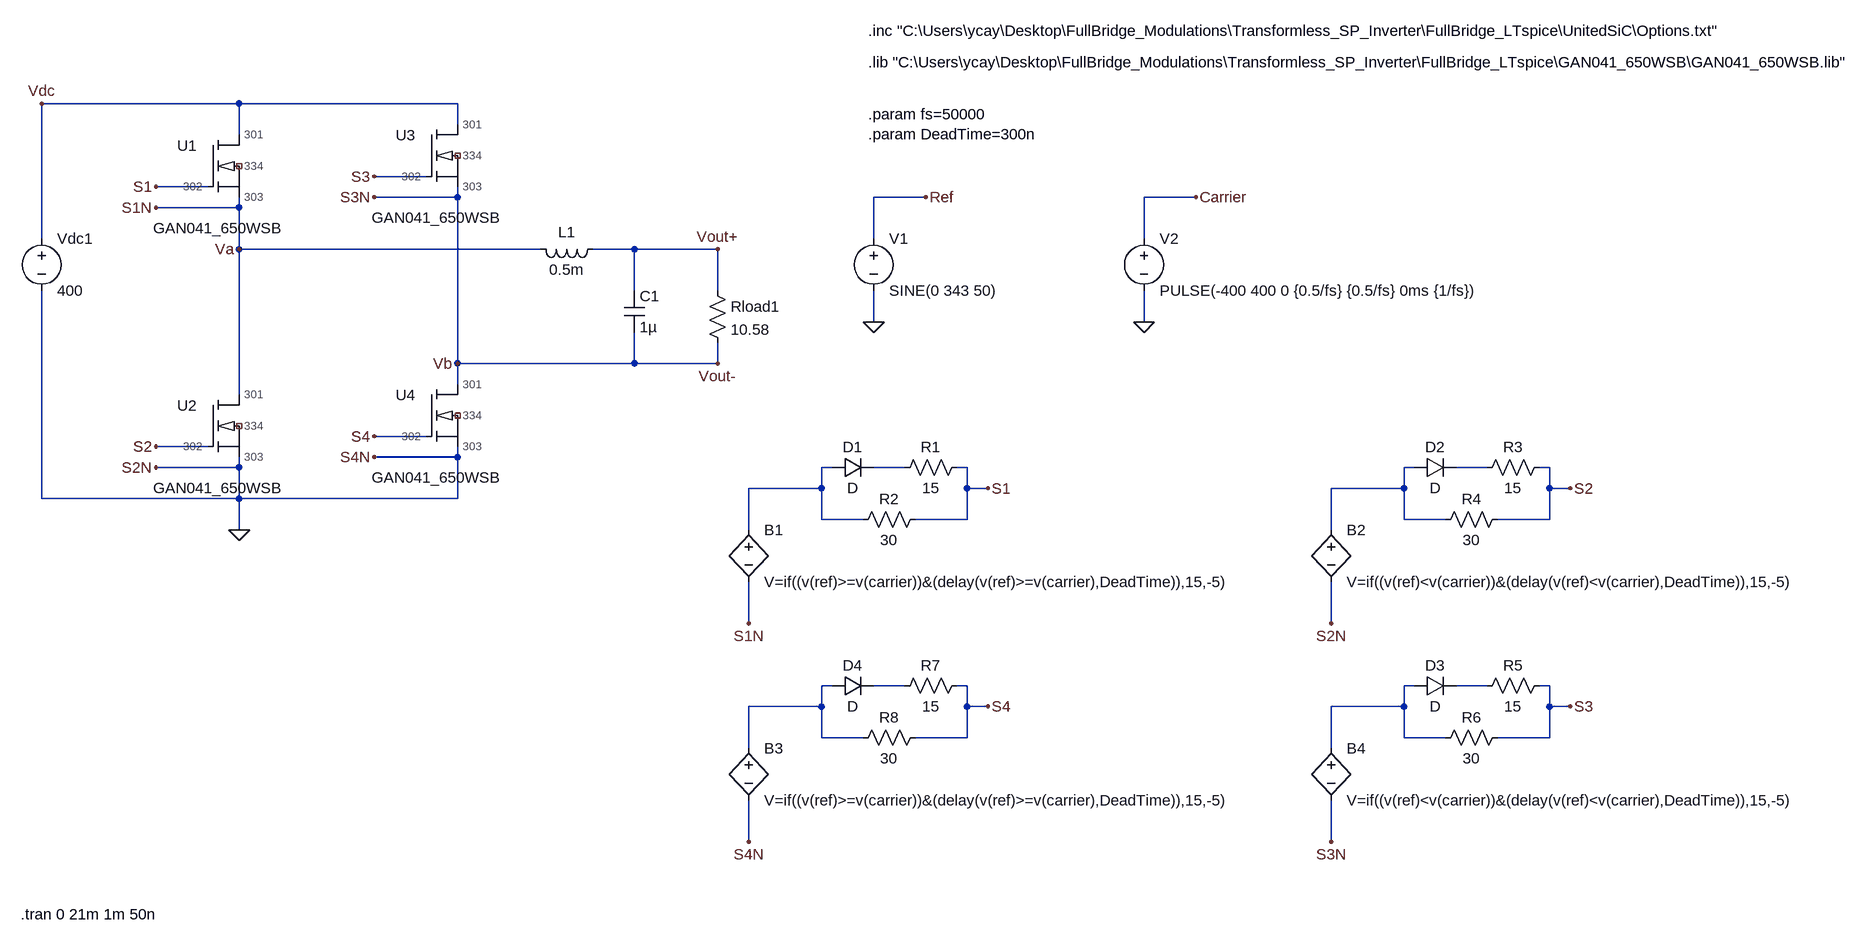
[diagram p0: schematic Bipolar_GAN041_650WSB.asc]
Bipolar_GAN041_650WSB.asc, the LTspice schematic file:
Version 4
SHEET 1 1652 768
WIRE -992 -496 -1296 -496
WIRE -656 -496 -992 -496
WIRE -656 -464 -656 -496
WIRE -992 -448 -992 -496
WIRE -704 -384 -784 -384
WIRE -1040 -368 -1120 -368
WIRE -656 -352 -656 -368
WIRE -656 -352 -784 -352
WIRE 64 -352 -16 -352
WIRE 480 -352 400 -352
WIRE -992 -336 -992 -352
WIRE -992 -336 -1120 -336
WIRE -1296 -288 -1296 -496
WIRE -16 -288 -16 -352
WIRE 400 -288 400 -352
WIRE -992 -272 -992 -336
WIRE -528 -272 -992 -272
WIRE -384 -272 -448 -272
WIRE -256 -272 -384 -272
WIRE -384 -208 -384 -272
WIRE -256 -208 -256 -272
WIRE -16 -160 -16 -208
WIRE 400 -160 400 -208
WIRE -656 -96 -656 -352
WIRE -384 -96 -384 -144
WIRE -384 -96 -656 -96
WIRE -256 -96 -256 -128
WIRE -256 -96 -384 -96
WIRE -656 -64 -656 -96
WIRE -992 -48 -992 -272
WIRE -704 16 -784 16
WIRE -1040 32 -1120 32
WIRE -656 48 -656 32
WIRE -656 48 -784 48
WIRE -992 64 -992 48
WIRE -992 64 -1120 64
WIRE -80 64 -96 64
WIRE 32 64 -16 64
WIRE 128 64 112 64
WIRE 816 64 800 64
WIRE 928 64 880 64
WIRE 1024 64 1008 64
WIRE -96 96 -96 64
WIRE -96 96 -208 96
WIRE 128 96 128 64
WIRE 160 96 128 96
WIRE 800 96 800 64
WIRE 800 96 688 96
WIRE 1024 96 1024 64
WIRE 1056 96 1024 96
WIRE -1296 112 -1296 -208
WIRE -992 112 -992 64
WIRE -992 112 -1296 112
WIRE -656 112 -656 48
WIRE -656 112 -992 112
WIRE -96 144 -96 96
WIRE -32 144 -96 144
WIRE 128 144 128 96
WIRE 128 144 48 144
WIRE 800 144 800 96
WIRE 864 144 800 144
WIRE 1024 144 1024 96
WIRE 1024 144 944 144
WIRE -992 160 -992 112
WIRE -208 160 -208 96
WIRE 688 160 688 96
WIRE -208 304 -208 240
WIRE 688 304 688 240
WIRE -80 400 -96 400
WIRE 32 400 -16 400
WIRE 128 400 112 400
WIRE 816 400 800 400
WIRE 928 400 880 400
WIRE 1024 400 1008 400
WIRE -96 432 -96 400
WIRE -96 432 -208 432
WIRE 128 432 128 400
WIRE 160 432 128 432
WIRE 800 432 800 400
WIRE 800 432 688 432
WIRE 1024 432 1024 400
WIRE 1056 432 1024 432
WIRE -96 480 -96 432
WIRE -32 480 -96 480
WIRE 128 480 128 432
WIRE 128 480 48 480
WIRE 800 480 800 432
WIRE 864 480 800 480
WIRE 1024 480 1024 432
WIRE 1024 480 944 480
WIRE -208 496 -208 432
WIRE 688 496 688 432
WIRE -208 640 -208 576
WIRE 688 640 688 576
FLAG -16 -160 0
FLAG 64 -352 Ref
FLAG 400 -160 0
FLAG 480 -352 Carrier
FLAG 160 96 S1
FLAG 1056 96 S2
FLAG -992 160 0
FLAG -256 -272 Vout+
FLAG -256 -96 Vout-
FLAG -208 304 S1N
FLAG 688 304 S2N
FLAG 160 432 S4
FLAG -208 640 S4N
FLAG 1056 432 S3
FLAG 688 640 S3N
FLAG -1120 -368 S1
FLAG -1120 -336 S1N
FLAG -784 16 S4
FLAG -784 48 S4N
FLAG -1120 32 S2
FLAG -1120 64 S2N
FLAG -784 -384 S3
FLAG -784 -352 S3N
FLAG -1296 -496 Vdc
FLAG -992 -272 Va
FLAG -656 -96 Vb
SYMBOL voltage -16 -304 R0
WINDOW 123 0 0 Left 0
WINDOW 39 0 0 Left 0
SYMATTR InstName V1
SYMATTR Value SINE(0 343 50)
SYMBOL voltage 400 -304 R0
WINDOW 123 0 0 Left 0
WINDOW 39 0 0 Left 0
SYMATTR InstName V2
SYMATTR Value PULSE(-400 400 0 {0.5/fs} {0.5/fs} 0ms {1/fs})
SYMBOL bv -208 144 R0
SYMATTR InstName B1
SYMATTR Value V=if((v(ref)>=v(carrier))&(delay(v(ref)>=v(carrier),DeadTime)),15,-5)
SYMBOL bv 688 144 R0
SYMATTR InstName B2
SYMATTR Value V=if((v(ref)<v(carrier))&(delay(v(ref)<v(carrier),DeadTime)),15,-5)
SYMBOL ind -432 -288 R90
WINDOW 0 5 56 VBottom 2
WINDOW 3 32 56 VTop 2
SYMATTR InstName L1
SYMATTR Value 0.5m
SYMATTR SpiceLine Rser=30m
SYMBOL res -272 -224 R0
SYMATTR InstName Rload1
SYMATTR Value 10.58
SYMBOL voltage -1296 -304 R0
WINDOW 123 0 0 Left 0
WINDOW 39 0 0 Left 0
SYMATTR InstName Vdc1
SYMATTR Value 400
SYMBOL cap -400 -208 R0
SYMATTR InstName C1
SYMATTR Value 1µ
SYMATTR SpiceLine Rser=0.11m
SYMBOL res 128 48 R90
WINDOW 0 0 56 VBottom 2
WINDOW 3 32 56 VTop 2
SYMATTR InstName R1
SYMATTR Value 15
SYMBOL diode -80 80 R270
WINDOW 0 32 32 VTop 2
WINDOW 3 0 32 VBottom 2
SYMATTR InstName D1
SYMBOL res 64 128 R90
WINDOW 0 0 56 VBottom 2
WINDOW 3 32 56 VTop 2
SYMATTR InstName R2
SYMATTR Value 30
SYMBOL bv -208 480 R0
SYMATTR InstName B3
SYMATTR Value V=if((v(ref)>=v(carrier))&(delay(v(ref)>=v(carrier),DeadTime)),15,-5)
SYMBOL bv 688 480 R0
SYMATTR InstName B4
SYMATTR Value V=if((v(ref)<v(carrier))&(delay(v(ref)<v(carrier),DeadTime)),15,-5)
SYMBOL res 1024 48 R90
WINDOW 0 0 56 VBottom 2
WINDOW 3 32 56 VTop 2
SYMATTR InstName R3
SYMATTR Value 15
SYMBOL diode 816 80 R270
WINDOW 0 32 32 VTop 2
WINDOW 3 0 32 VBottom 2
SYMATTR InstName D2
SYMBOL res 960 128 R90
WINDOW 0 0 56 VBottom 2
WINDOW 3 32 56 VTop 2
SYMATTR InstName R4
SYMATTR Value 30
SYMBOL res 1024 384 R90
WINDOW 0 0 56 VBottom 2
WINDOW 3 32 56 VTop 2
SYMATTR InstName R5
SYMATTR Value 15
SYMBOL diode 816 416 R270
WINDOW 0 32 32 VTop 2
WINDOW 3 0 32 VBottom 2
SYMATTR InstName D3
SYMBOL res 960 464 R90
WINDOW 0 0 56 VBottom 2
WINDOW 3 32 56 VTop 2
SYMATTR InstName R6
SYMATTR Value 30
SYMBOL res 128 384 R90
WINDOW 0 0 56 VBottom 2
WINDOW 3 32 56 VTop 2
SYMATTR InstName R7
SYMATTR Value 15
SYMBOL diode -80 416 R270
WINDOW 0 32 32 VTop 2
WINDOW 3 0 32 VBottom 2
SYMATTR InstName D4
SYMBOL res 64 464 R90
WINDOW 0 0 56 VBottom 2
WINDOW 3 32 56 VTop 2
SYMATTR InstName R8
SYMATTR Value 30
SYMBOL AutoGenerated\\GAN041_650WSB -1024 -400 R0
SYMATTR InstName U1
SYMBOL AutoGenerated\\GAN041_650WSB -1024 0 R0
SYMATTR InstName U2
SYMBOL AutoGenerated\\GAN041_650WSB -688 -416 R0
SYMATTR InstName U3
SYMBOL AutoGenerated\\GAN041_650WSB -688 -16 R0
SYMATTR InstName U4
TEXT -24 -480 Left 2 !.param fs=50000\n.param DeadTime=300n
TEXT -24 -560 Left 2 !.lib "C:\\Users\\ycay\\Desktop\\FullBridge_Modulations\\Transformless_SP_Inverter\\FullBridge_LTspice\\GAN041_650WSB\\GAN041_650WSB.lib"
TEXT -24 -608 Left 2 !.inc "C:\\Users\\ycay\\Desktop\\FullBridge_Modulations\\Transformless_SP_Inverter\\FullBridge_LTspice\\UnitedSiC\\Options.txt"
TEXT -1328 752 Left 2 !.tran 0 21m 1m 50n

The netlist it stands for:
* Bipolar_GAN041_650WSB.asc
V1 Ref 0 SINE(0 343 50)
V2 Carrier 0 PULSE(-400 400 0 {0.5/fs} {0.5/fs} 0ms {1/fs})
B1 N001 Va V=if((v(ref)>=v(carrier))&(delay(v(ref)>=v(carrier),DeadTime)),15,-5)
B2 N003 0 V=if((v(ref)<v(carrier))&(delay(v(ref)<v(carrier),DeadTime)),15,-5)
L1 Vout+ Va 0.5m Rser=30m
Rload1 Vout+ Vb 10.58
Vdc1 Vdc 0 400
C1 Vout+ Vb 1µ Rser=0.11m
R1 S1 N002 15
D1 N001 N002 D
R2 S1 N001 30
B3 N005 0 V=if((v(ref)>=v(carrier))&(delay(v(ref)>=v(carrier),DeadTime)),15,-5)
B4 N007 Vb V=if((v(ref)<v(carrier))&(delay(v(ref)<v(carrier),DeadTime)),15,-5)
R3 S2 N004 15
D2 N003 N004 D
R4 S2 N003 30
R5 S3 N008 15
D3 N007 N008 D
R6 S3 N007 30
R7 S4 N006 15
D4 N005 N006 D
R8 S4 N005 30
XU1 Vdc S1 Va NC_01 GAN041_650WSB  ; pins 301 302 303 334
XU2 Va S2 0 NC_02 GAN041_650WSB  ; pins 301 302 303 334
XU3 Vdc S3 Vb NC_03 GAN041_650WSB  ; pins 301 302 303 334
XU4 Vb S4 0 NC_04 GAN041_650WSB  ; pins 301 302 303 334
.model D D
.lib standard.dio
.param fs=50000
.param DeadTime=300n
.lib "C:\Users\ycay\Desktop\FullBridge_Modulations\Transformless_SP_Inverter\FullBridge_LTspice\GAN041_650WSB\GAN041_650WSB.lib"
.inc "C:\Users\ycay\Desktop\FullBridge_Modulations\Transformless_SP_Inverter\FullBridge_LTspice\UnitedSiC\Options.txt"
.tran 0 21m 1m 50n
.lib C:\Users\ycay\Desktop\FullBridge_Modulations\Transformless_SP_Inverter\FullBridge_LTspice\UnitedSiC\UF3C065040K4S.txt
.backanno
.end